# EAGLE schematic shield (EAGLE 6.6.0)
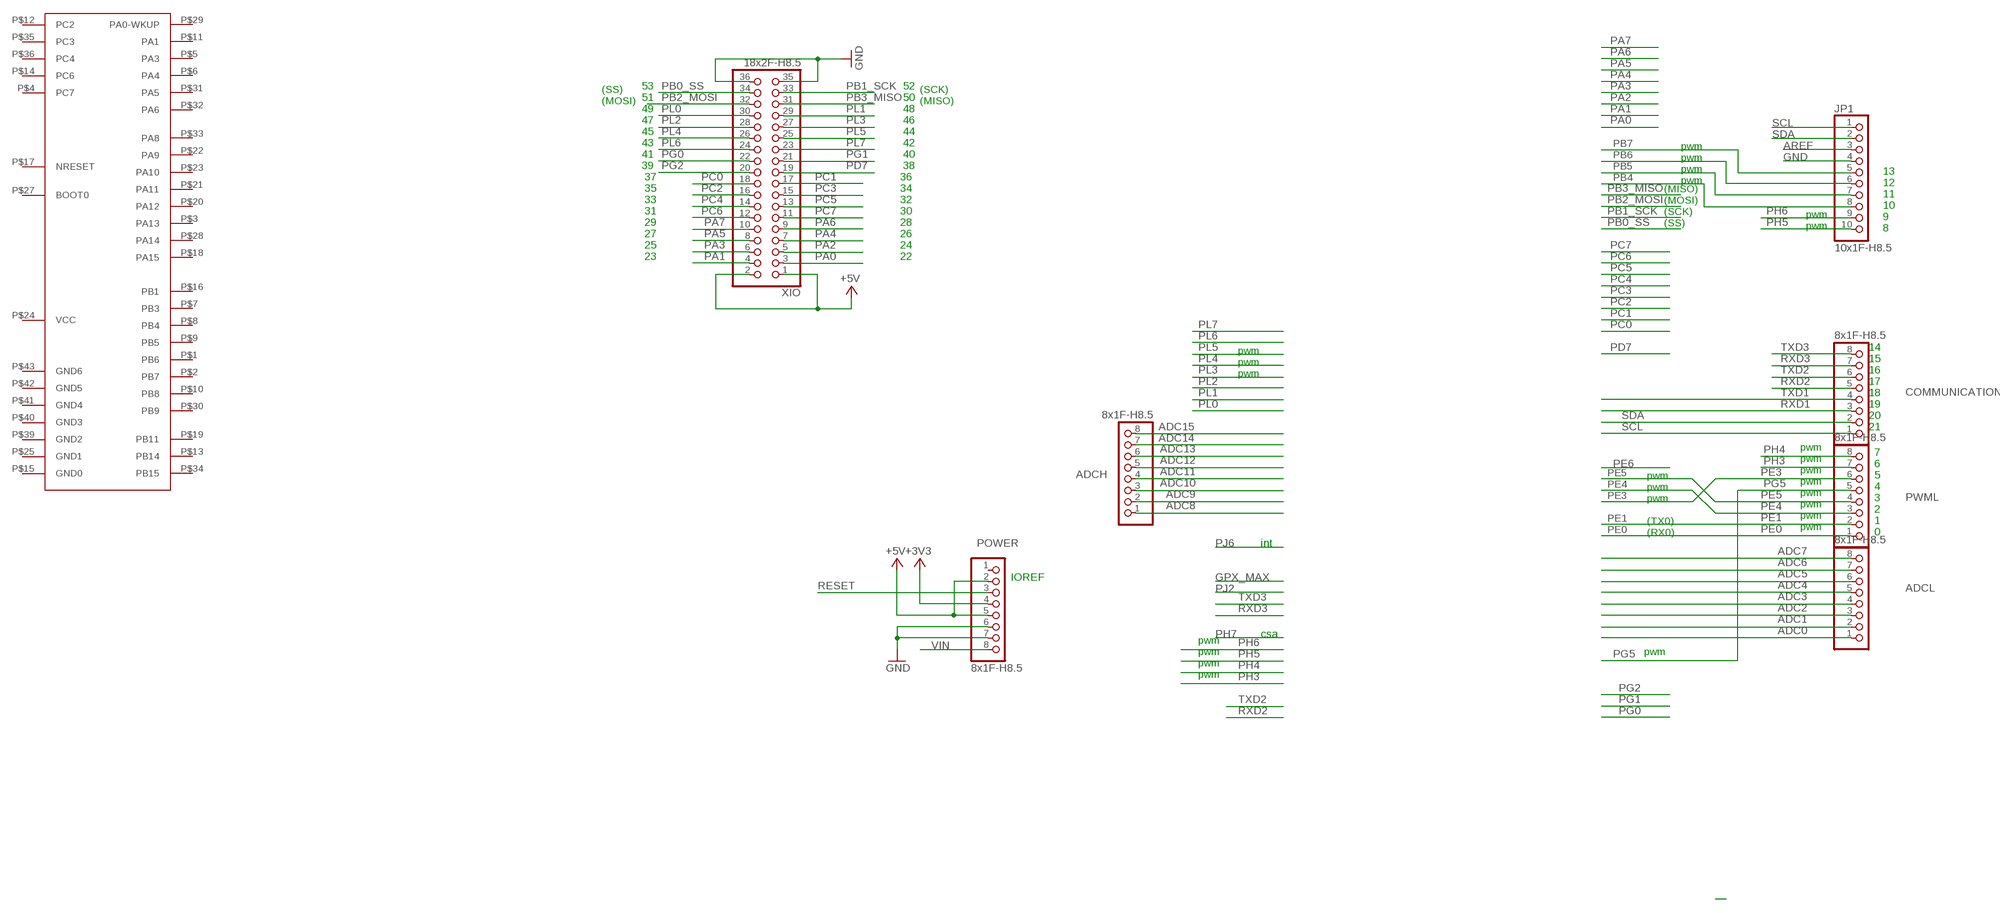
[diagram p0: schematic, sheet 1]

## Parts
ADCH  8x1F-H8.5  PINHD-1X8  [1X08]
ADCL  8x1F-H8.5  PINHD-1X8  [1X08]
COMMUNICATION  8x1F-H8.5  PINHD-1X8  [1X08]
JP1  10x1F-H8.5  PINHD-1X10  [1X10]
POWER  8x1F-H8.5  PINHD-1X8  [1X08]
PWML  8x1F-H8.5  PINHD-1X8  [1X08]
U$1  EMW3162  [EMW3162]
XIO  18x2F-H8.5  PINHD-2X18  [2X18]

## Nets
+3V3 [power]: POWER.4
+5V [power usb]: POWER.2 POWER.5 XIO.1 XIO.2
ADC0: ADCL.1
ADC1: ADCL.2
ADC2: ADCL.3
ADC3: ADCL.4
ADC4: ADCL.5
ADC5: ADCL.6
ADC6: ADCL.7
ADC7: ADCL.8
ADC8: ADCH.1
ADC9: ADCH.2
ADC10: ADCH.3
ADC11: ADCH.4
ADC12: ADCH.5
ADC13: ADCH.6
ADC14: ADCH.7
ADC15: ADCH.8
AREF: JP1.3
GND [gnd]: JP1.4 POWER.6 POWER.7 XIO.35 XIO.36
PA0: XIO.3
PA1: XIO.4
PA2: XIO.5
PA3: XIO.6
PA4: XIO.7
PA5: XIO.8
PA6: XIO.9
PA7: XIO.10
PB0_SS: XIO.34
PB1_SCK: XIO.33
PB2_MOSI: XIO.32
PB3_MISO: XIO.31
PB4: JP1.8
PB5: JP1.7
PB6: JP1.6
PB7: JP1.5
PC0: XIO.18
PC1: XIO.17
PC2: XIO.16
PC3: XIO.15
PC4: XIO.14
PC5: XIO.13
PC6: XIO.12
PC7: XIO.11
PD7: XIO.19
PE0: PWML.1
PE1: PWML.2
PE3: PWML.6
PE4: PWML.3
PE5: PWML.4
PG0: XIO.22
PG1: XIO.21
PG2: XIO.20
PG5: PWML.5
PH3: PWML.7
PH4: PWML.8
PH5: JP1.10
PH6: JP1.9
PL0: XIO.30
PL1: XIO.29
PL2: XIO.28
PL3: XIO.27
PL4: XIO.26
PL5: XIO.25
PL6: XIO.24
PL7: XIO.23
RESET: POWER.3
RXD1: COMMUNICATION.3
RXD2: COMMUNICATION.5
RXD3: COMMUNICATION.7
SCL: COMMUNICATION.1 JP1.1
SDA: COMMUNICATION.2 JP1.2
TXD1: COMMUNICATION.4
TXD2: COMMUNICATION.6
TXD3: COMMUNICATION.8
VIN [power]: POWER.8
Unconnected: POWER.1 U$1.P$1(PB6) U$1.P$2(PB7) U$1.P$3(PA13) U$1.P$4(PC7) U$1.P$5(PA3) U$1.P$6(PA4) U$1.P$7(PB3) U$1.P$8(PB4) U$1.P$9(PB5) U$1.P$10(PB8) U$1.P$11(PA1) U$1.P$12(PC2) U$1.P$13(PB14) U$1.P$14(PC6) U$1.P$15(GND0) U$1.P$16(PB1) U$1.P$17(NRESET) U$1.P$18(PA15) U$1.P$19(PB11) U$1.P$20(PA12) U$1.P$21(PA11) U$1.P$22(PA9) U$1.P$23(PA10) U$1.P$24(VCC) U$1.P$25(GND1) U$1.P$27(BOOT0) U$1.P$28(PA14) U$1.P$29(PA0-WKUP) U$1.P$30(PB9) U$1.P$31(PA5) U$1.P$32(PA6) U$1.P$33(PA8) U$1.P$34(PB15) U$1.P$35(PC3) U$1.P$36(PC4) U$1.P$39(GND2) U$1.P$40(GND3) U$1.P$41(GND4) U$1.P$42(GND5) U$1.P$43(GND6)

## Notes on the sheet
- (SS) | 53 | 52 | (SCK)
- (MOSI) | 51 | 50 | (MISO)
- 49 | 48
- 47 | 46
- 45 | 44
- 43 | 42 | pwm
- 41 | 40 | pwm
- 39 | 38 | pwm
- 13
- 37 | 36 | pwm
- 12
- 35 | 34 | (MISO)
- 11
- 33 | 32 | (MOSI)
- 10
- 31 | 30 | (SCK) | pwm
- 9
- 29 | 28 | (SS) | pwm
- 8
- 27 | 26
- 25 | 24
- 23 | 22
- pwm | 14
- pwm | 15
- pwm | 16
- 17
- 18
- 19
- 20
- 21
- pwm
- 7
- pwm
- 6
- pwm
- pwm | 5
- pwm
- pwm | 4
- pwm
- pwm | 3
- pwm
- 2
- pwm
- (TX0) | 1
- pwm
- (RX0) | 0
- int
- IOREF
- csa
- pwm
- pwm | pwm
- pwm
- pwm

## Library data of the parts
ADCH ADCL COMMUNICATION POWER PWML = SmartPrj:PINHD-1X8: PIN HEADER
JP1 = SmartPrj:PINHD-1X10: PIN HEADER
U$1 = my:EMW3162
XIO = SmartPrj:PINHD-2X18: PIN HEADER

## Net classes
0 default: width 0.203 mm, drill 0.406 mm, clearance 0.178 mm
1 power: width 0.305 mm, drill 0.406 mm, clearance 0.178 mm
2 gnd: width 0.305 mm, drill 0.406 mm, clearance 0.178 mm
3 power usb: width 0.508 mm, drill 0.406 mm, clearance 0.178 mm